# Altium schematic sheet HA_Diagram.SchDoc
size A4; PageSetup: Record=PageOptions|CenterHorizontal=True|CenterVertical=True|PrintScale=1.00|XCorrection=1.00|YCorrection=1.00|PrintKind=0|BorderSize=5000000|LeftOffset=0|BottomOffset=0|Orientation=2|PaperLength=1000|PaperWidth=1000|Scale=100|PaperSource=7|PrintQuality=-3|MediaType=1|DitherType=10|PrintScaleMode=1|PaperKind=A4|PaperIndex=9
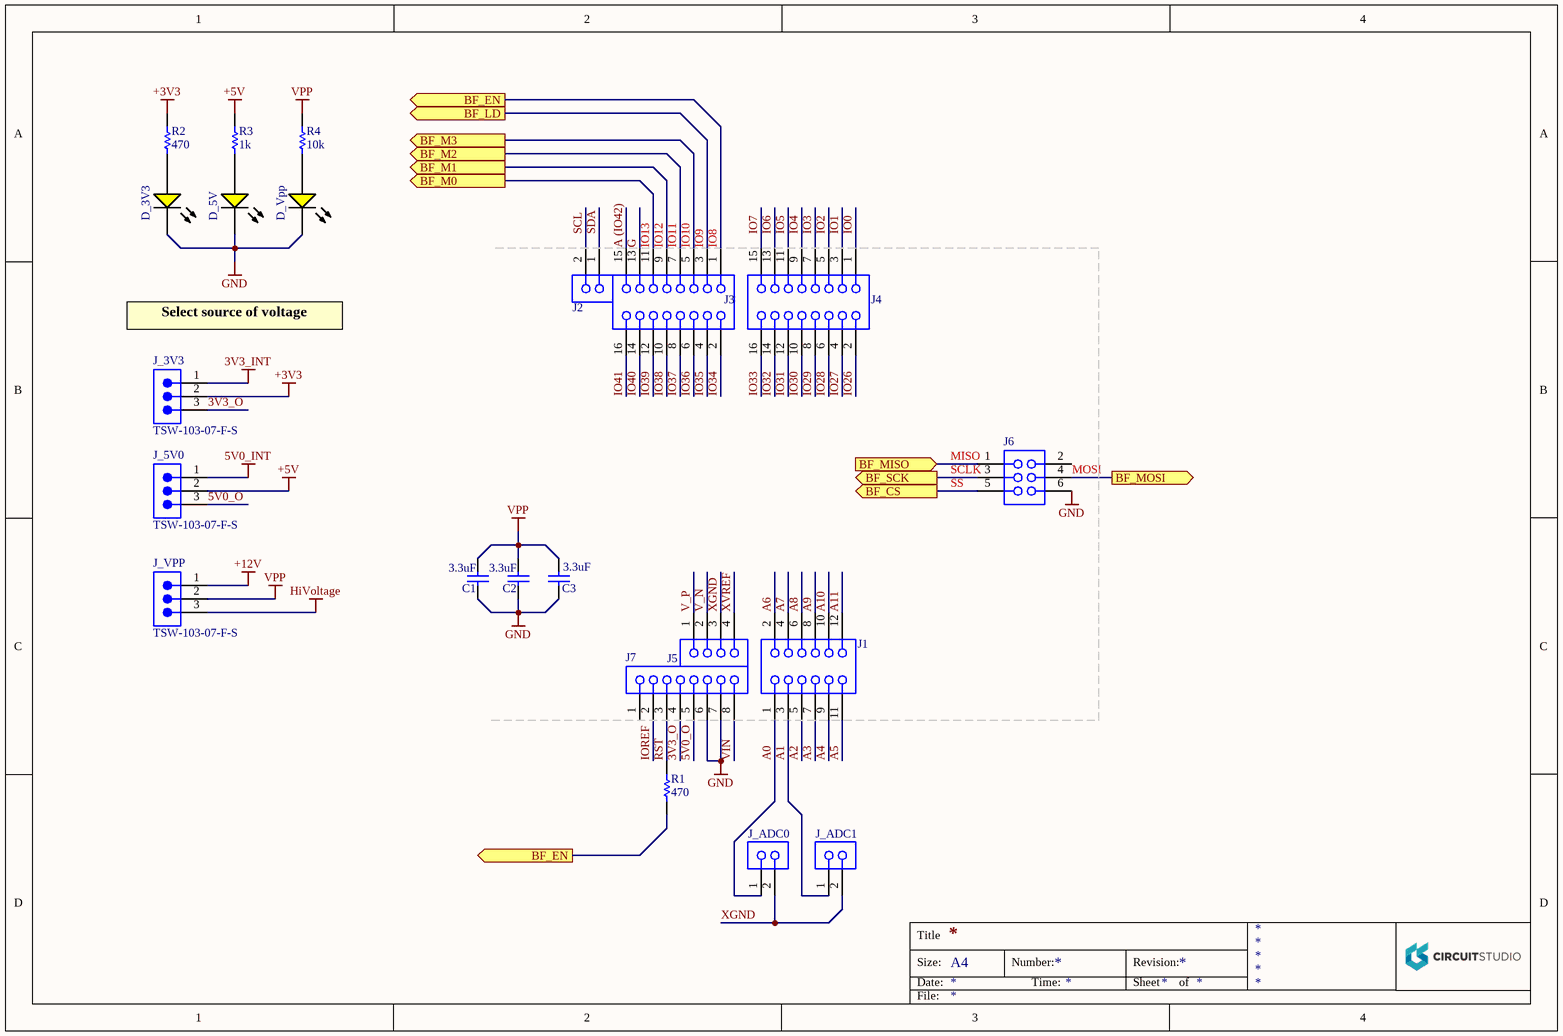
[diagram p0: HA_Diagram.SchDoc]

## Parts
C1  value 3.3uF  [CAPC1206(3216)190_N]  (hidden comment: 3.3uF 100V)
C2  value 3.3uF  [CAPC1206(3216)190_N]  (hidden comment: 3.3uF 100V)
C3  value 3.3uF  [CAPC1206(3216)190_N]  (hidden comment: 3.3uF 100V)
D_3V3  LED 0603  [LTST-C190KSKT_V]  (value not drawn)
D_5V  LED 0603  [LTST-C190KSKT_V]  (value not drawn)
D_Vpp  LED 0603  [LTST-C190KSKT_V]  (value not drawn)
J1  SSW-106-01-F-D  [SMTC-SSW-106-01-X-D]  (value not drawn)
J2  PHF-102-03-L-S  [SMTC-PHF-102-03-X-S]  (value not drawn)
J3  ESW-108-12-G-D  [SMTC-ESW-108-12-X-D]  (value not drawn)
J4  ESW-108-12-G-D  [SMTC-ESW-108-12-X-D]  (value not drawn)
J5  SLW-104-01-F-S  [SMTC-SLW-104-01-X-S]  (value not drawn)
J6  SSW-103-01-F-D  [SMTC-SSW-103-01-X-D]  (value not drawn)
J7  SSQ-108-01-F-S  [SMTC-SSQ-108-01-X-S]  (value not drawn)
J_3V3  TSW-103-07-F-S  [SMTC-TSW-103-07-X-S]
J_5V0  TSW-103-07-F-S  [SMTC-TSW-103-07-X-S]
J_ADC0  PHF-102-03-L-S  [SMTC-PHF-102-03-X-S]  (value not drawn)
J_ADC1  PHF-102-03-L-S  [SMTC-PHF-102-03-X-S]  (value not drawn)
J_VPP  TSW-103-07-F-S  [SMTC-TSW-103-07-X-S]
R1  470  [RESC0603(1608)_N]
R2  470  [RESC0603(1608)_N]
R3  1k  [RESC0603(1608)_N]
R4  10k  [RESC0603(1608)_N]

## Ports
BF_CS (out), BF_EN (out), BF_LD (out), BF_M0 (out), BF_M1 (out), BF_M2 (out), BF_M3 (out), BF_MISO (in), BF_MOSI (out), BF_SCK (out)

## Nets
3V3_INT: J_3V3.1
5V0_INT: J_5V0.1
+3V3: J_3V3.2 R2.1
+5V: J_5V0.2 R3.1
+12V: J_VPP.1
GND: C1.1 C2.1 C3.1 D_3V3.2(K) D_5V.2(K) D_Vpp.2(K) J6.6 J7.6 J7.7
HiVoltage: J_VPP.3
VPP: C1.2 C2.2 C3.2 J_VPP.2 R4.1
3V3_O: J7.4 J_3V3.3
5V0_O: J7.5 J_5V0.3
A0: J1.1 J_ADC0.1
A1: J1.3 J_ADC1.1
A2: J1.5
A3: J1.7
A4: J1.9
A5: J1.11
A6: J1.2
A7: J1.4
A8: J1.6
A9: J1.8
A10: J1.10
A11: J1.12
A (IO42): J3.15
BF_CS: J6.5 ; port BF_CS
BF_EN: J3.1 R1.2 ; port BF_EN
BF_LD: J3.3 ; port BF_LD
BF_M0: J3.11 ; port BF_M0
BF_M1: J3.9 ; port BF_M1
BF_M2: J3.7 ; port BF_M2
BF_M3: J3.5 ; port BF_M3
BF_MISO: J6.1 ; port BF_MISO
BF_MOSI: J6.4 ; port BF_MOSI
BF_SCK: J6.3 ; port BF_SCK
G: J3.13
IO0: J4.1
IO1: J4.3
IO2: J4.5
IO3: J4.7
IO4: J4.9
IO5: J4.11
IO6: J4.13
IO7: J4.15
IO26: J4.2
IO27: J4.4
IO28: J4.6
IO29: J4.8
IO30: J4.10
IO31: J4.12
IO32: J4.14
IO33: J4.16
IO34: J3.2
IO35: J3.4
IO36: J3.6
IO37: J3.8
IO38: J3.10
IO39: J3.12
IO40: J3.14
IO41: J3.16
IOREF: J7.2
RST: J7.3 R1.1
SCL: J2.2
SDA: J2.1
V_N: J5.2
V_P: J5.1
VIN: J7.8
XGND: J5.3 J_ADC0.2 J_ADC1.2
XVREF: J5.4
NetD_3V3_1: D_3V3.1(A) R2.2
NetD_5V_1: D_5V.1(A) R3.2
NetD_Vpp_1: D_Vpp.1(A) R4.2

Not connected (* = marked no-connect by the designer): J6 2; J7 1

## Notes on the sheet
- (near J3) IO13
- (near J3) IO12
- (near J3) IO11
- (near J3) IO10
- (near J3) IO9
- (near J3) IO8
- Select source of voltage
- (near J6) MISO
- (near J6) SCLK
- (near J6) SS
- (near J6) MOSI
- Title
- Size:
- Date:
- A4
- Number:
- Time:
- Revision:
- Sheet
- of
- File:

## Library data of the parts
C1-C3 = CMP-1037-04411-1: CAP 3.3uF 100V ±20% 1206 (3216 Metric) Thickness 1.9mm SMD; Case-Metric: 3216; Tolerance: Â±20%; Case-EIA: 1206; Max Thickness: 1.9 mm; Rated Voltage: 100 V; Technology: SMT
D_3V3 D_5V D_Vpp = CMP-1674-00009-1: Voltage Rating: 50 V; Case\Package: 0603; Power Rating: 100 mW; Tolerance: 1%; Resistance: 12 kohm; Packaging: Tape and Reel; RoHSCompliant: true; Height: 0.45 mm; Max Operating Temperature: 155 degC; Mount: Surface Mount; DatasheetVersion: Rev. I, 10/2012; Min Operating Temperature: -55 degC; PackageReference: C190KSKT; ComponentLink1Description: Manufacturer URL; Length: 1.6 mm; REACH SVHC: No SVHC; Case Code (Imperial): 0603; Voltage Rating (DC): 50 V; PackageDescription: 2-Pin Surface Mount Device, Body 1.6 x 0.8 mm; Case Code (Metric): 1608; Package Quantity: 5000; ComponentLink2Description: Datasheet; Width: 0.8 mm; Pins: 2; ComponentLink2URL: http://optoelectronics.liteon.com/upload/download/DS-22-99-0189/S_110_LTST-C190KSKT.pdf; ComponentLink1URL: http://www.us.liteon.com/
J1 = CMP-1023-00357-1: SQ Post Socket, Through-hole, Vertical, -55 to 125 degC, 2.54mm Pitch, 12-Pin, Female, RoHS; Manufacturer: Samtec; Temperature Range: -55 to 125 degC; ComponentLink3Description: Package Specification; RoHS: True; PackageDescription: Assembly, Socket Strip .016 X .031 Tail; ComponentLink2URL: http://www.samtec.com/documents/webfiles/pdf/SSW_TH.PDF; ComponentLink1Description: Manufacturer URL; DatasheetVersion: F-214; Orientation: Vertical; PackageReference: SSW-106-01-X-D; Pitch: 2.54 mm; ComponentLink3URL: http://www.samtec.com/documents/webfiles/cpdf/SSW-1XX-XX-XXX-X-XX-XXX-XX-MKT.pdf; PartNumber: SSW-106-01-F-D; Mounting Technology: Through-hole; ComponentLink1URL: http://www.samtec.com; ComponentLink2Description: Datasheet; PackageVersion: CA, 6/1987
J2 J_ADC0 J_ADC1 = CMP-1023-00105-1: Press Fit Socket, Through-hole, Vertical, -55 to 125 degC, 2.54 mm Pitch, 2-Pin, Female, RoHS; Manufacturer: Samtec; Pitch: 2.54 mm; Orientation: Vertical; RoHS: True; DatasheetVersion: F-214; PackageReference: PHF-102-03-X-S; Temperature Range: -55 to 125 degC; ComponentLink1Description: Manufacturer URL; ComponentLink3Description: Package Specification; PackageVersion: F, 9/2009; ComponentLink2Description: Datasheet; ComponentLink3URL: http://www.samtec.com/documents/webfiles/cpdf/PHF-1XX-XX-X-X-XXX-MKT.pdf; PartNumber: PHF-102-03-L-S; ComponentLink1URL: http://www.samtec.com; ComponentLink2URL: http://www.samtec.com/documents/webfiles/pdf/phf.pdf; Mounting Technology: Through-hole; PackageDescription: .100 Press Fit Socket Assembly
J3 J4 = CMP-1023-00046-1: Elevated Socket, Through-hole, Vertical, -55 to 125 degC, 2.54 mm Pitch, 16-Pin, Female, RoHS; Manufacturer: Samtec; Pitch: 2.54 mm; PackageVersion: AV, 7/1985; PackageReference: ESW-108-12-X-D; ComponentLink2Description: Datasheet; ComponentLink1Description: Manufacturer URL; DatasheetVersion: F-214; Temperature Range: -55 to 125 degC; Mounting Technology: Through-hole; PartNumber: ESW-108-12-G-D; RoHS: True; PackageDescription: ESW Strip ASM; ComponentLink3Description: Package Specification; ComponentLink2URL: http://www.samtec.com/documents/webfiles/pdf/ESW_TH.PDF; ComponentLink3URL: http://www.samtec.com/documents/webfiles/cpdf/ESW-1XX-XX-X-X-XX-XX-MKT.pdf; Orientation: Vertical; ComponentLink1URL: http://www.samtec.com
J5 = CMP-1023-00132-1: Low Profile Socket Strips, Through-hole, Vertical, -55 to 125 degC, 2.54 mm Pitch, 4-Pin, Female, RoHS; Manufacturer: Samtec; Pitch: 2.54 mm; PackageVersion: X, 9/1987; ComponentLink2Description: Datasheet; PackageDescription: Low Profile Socket Strip; ComponentLink1URL: http://www.samtec.com; Orientation: Vertical; ComponentLink3URL: http://www.samtec.com/documents/webfiles/cpdf/SLW-1XX-01-X-X-MKT.pdf; ComponentLink1Description: Manufacturer URL; ComponentLink2URL: http://www.samtec.com/documents/webfiles/pdf/SLW.PDF; PackageReference: SLW-104-01-X-S; Mounting Technology: Through-hole; PartNumber: SLW-104-01-F-S; Temperature Range: -55 to 125 degC; DatasheetVersion: F-214; ComponentLink3Description: Package Specification; RoHS: True
J6 = CMP-1023-00329-1: SQ Post Socket, Through-hole, Vertical, -55 to 125 degC, 2.54 mm Pitch, 6-Pin, Female, RoHS; Manufacturer: Samtec; Pitch: 2.54 mm; Temperature Range: -55 to 125 degC; ComponentLink3URL: http://www.samtec.com/documents/webfiles/cpdf/SSW-1XX-XX-XXX-X-XX-XXX-XX-MKT.pdf; ComponentLink1URL: http://www.samtec.com; Orientation: Vertical; PackageReference: SSW-103-01-X-D; RoHS: True; ComponentLink1Description: Manufacturer URL; PartNumber: SSW-103-01-F-D; PackageVersion: CA, 6/1987; ComponentLink2URL: http://www.samtec.com/documents/webfiles/pdf/SSW_TH.PDF; ComponentLink3Description: Package Specification; Mounting Technology: Through-hole; PackageDescription: Assembly, Socket Strip .016 X .031 Tail; DatasheetVersion: F-214; ComponentLink2Description: Datasheet
J7 = CMP-1023-00294-1: SQ Post Socket, Through-hole, Vertical, -55 to 125 degC, 2.54 mm Pitch, 8-Pin, Female, RoHS; Manufacturer: Samtec; Pitch: 2.54 mm; ComponentLink3URL: http://www.samtec.com/documents/webfiles/cpdf/SSQ-1XX-XX-XXX-X-XX-XXX-XX-X-MKT.pdf; ComponentLink2URL: http://www.samtec.com/documents/webfiles/pdf/SSQ_TH.PDF; Mounting Technology: Through-hole; PackageReference: SSQ-108-01-X-S; Orientation: Vertical; PackageDescription: Assembly, Socket Strip .025[0.64] SQ Tail; ComponentLink2Description: Datasheet; PartNumber: SSQ-108-01-F-S; Temperature Range: -55 to 125 degC; ComponentLink1URL: http://www.samtec.com; ComponentLink3Description: Package Specification; PackageVersion: BD, 6/1987; RoHS: True; ComponentLink1Description: Manufacturer URL; DatasheetVersion: F-214
J_3V3 J_5V0 J_VPP = CMP-1024-00331-1: 0.025" SQ Post Header, Through-hole, Vertical, -55 to 125 degC, 2.54 mm Pitch, 3-Pin, Male, RoHS; Manufacturer: Samtec; Pitch: 2.54 mm; DatasheetVersion: F-214; ComponentLink1Description: Manufacturer URL; ComponentLink3URL: http://www.samtec.com/documents/webfiles/cpdf/TSW-XXX-XX-XXX-X-XX-XXX-MKT.pdf; Mounting Technology: Through-hole; PackageDescription: .025[0.64] SQ. Post Terminal Strip Assembly; Temperature Range: -55 to 125 degC; ComponentLink3Description: Package Specification; Orientation: Vertical; PartNumber: TSW-103-07-F-S; RoHS: True; PackageVersion: DM, 8/1988; ComponentLink2Description: Datasheet; ComponentLink1URL: http://www.samtec.com; ComponentLink2URL: http://www.samtec.com/documents/webfiles/pdf/TSW_TH.PDF; PackageReference: TSW-103-07-X-S
R1-R4 = CMP-1012-00122-1: 200 1% 0603 SMD; Value: 200 Ohm; Tolerance: 1 %